# EAGLE design humidor_controller_v30 (EAGLE 5.06)
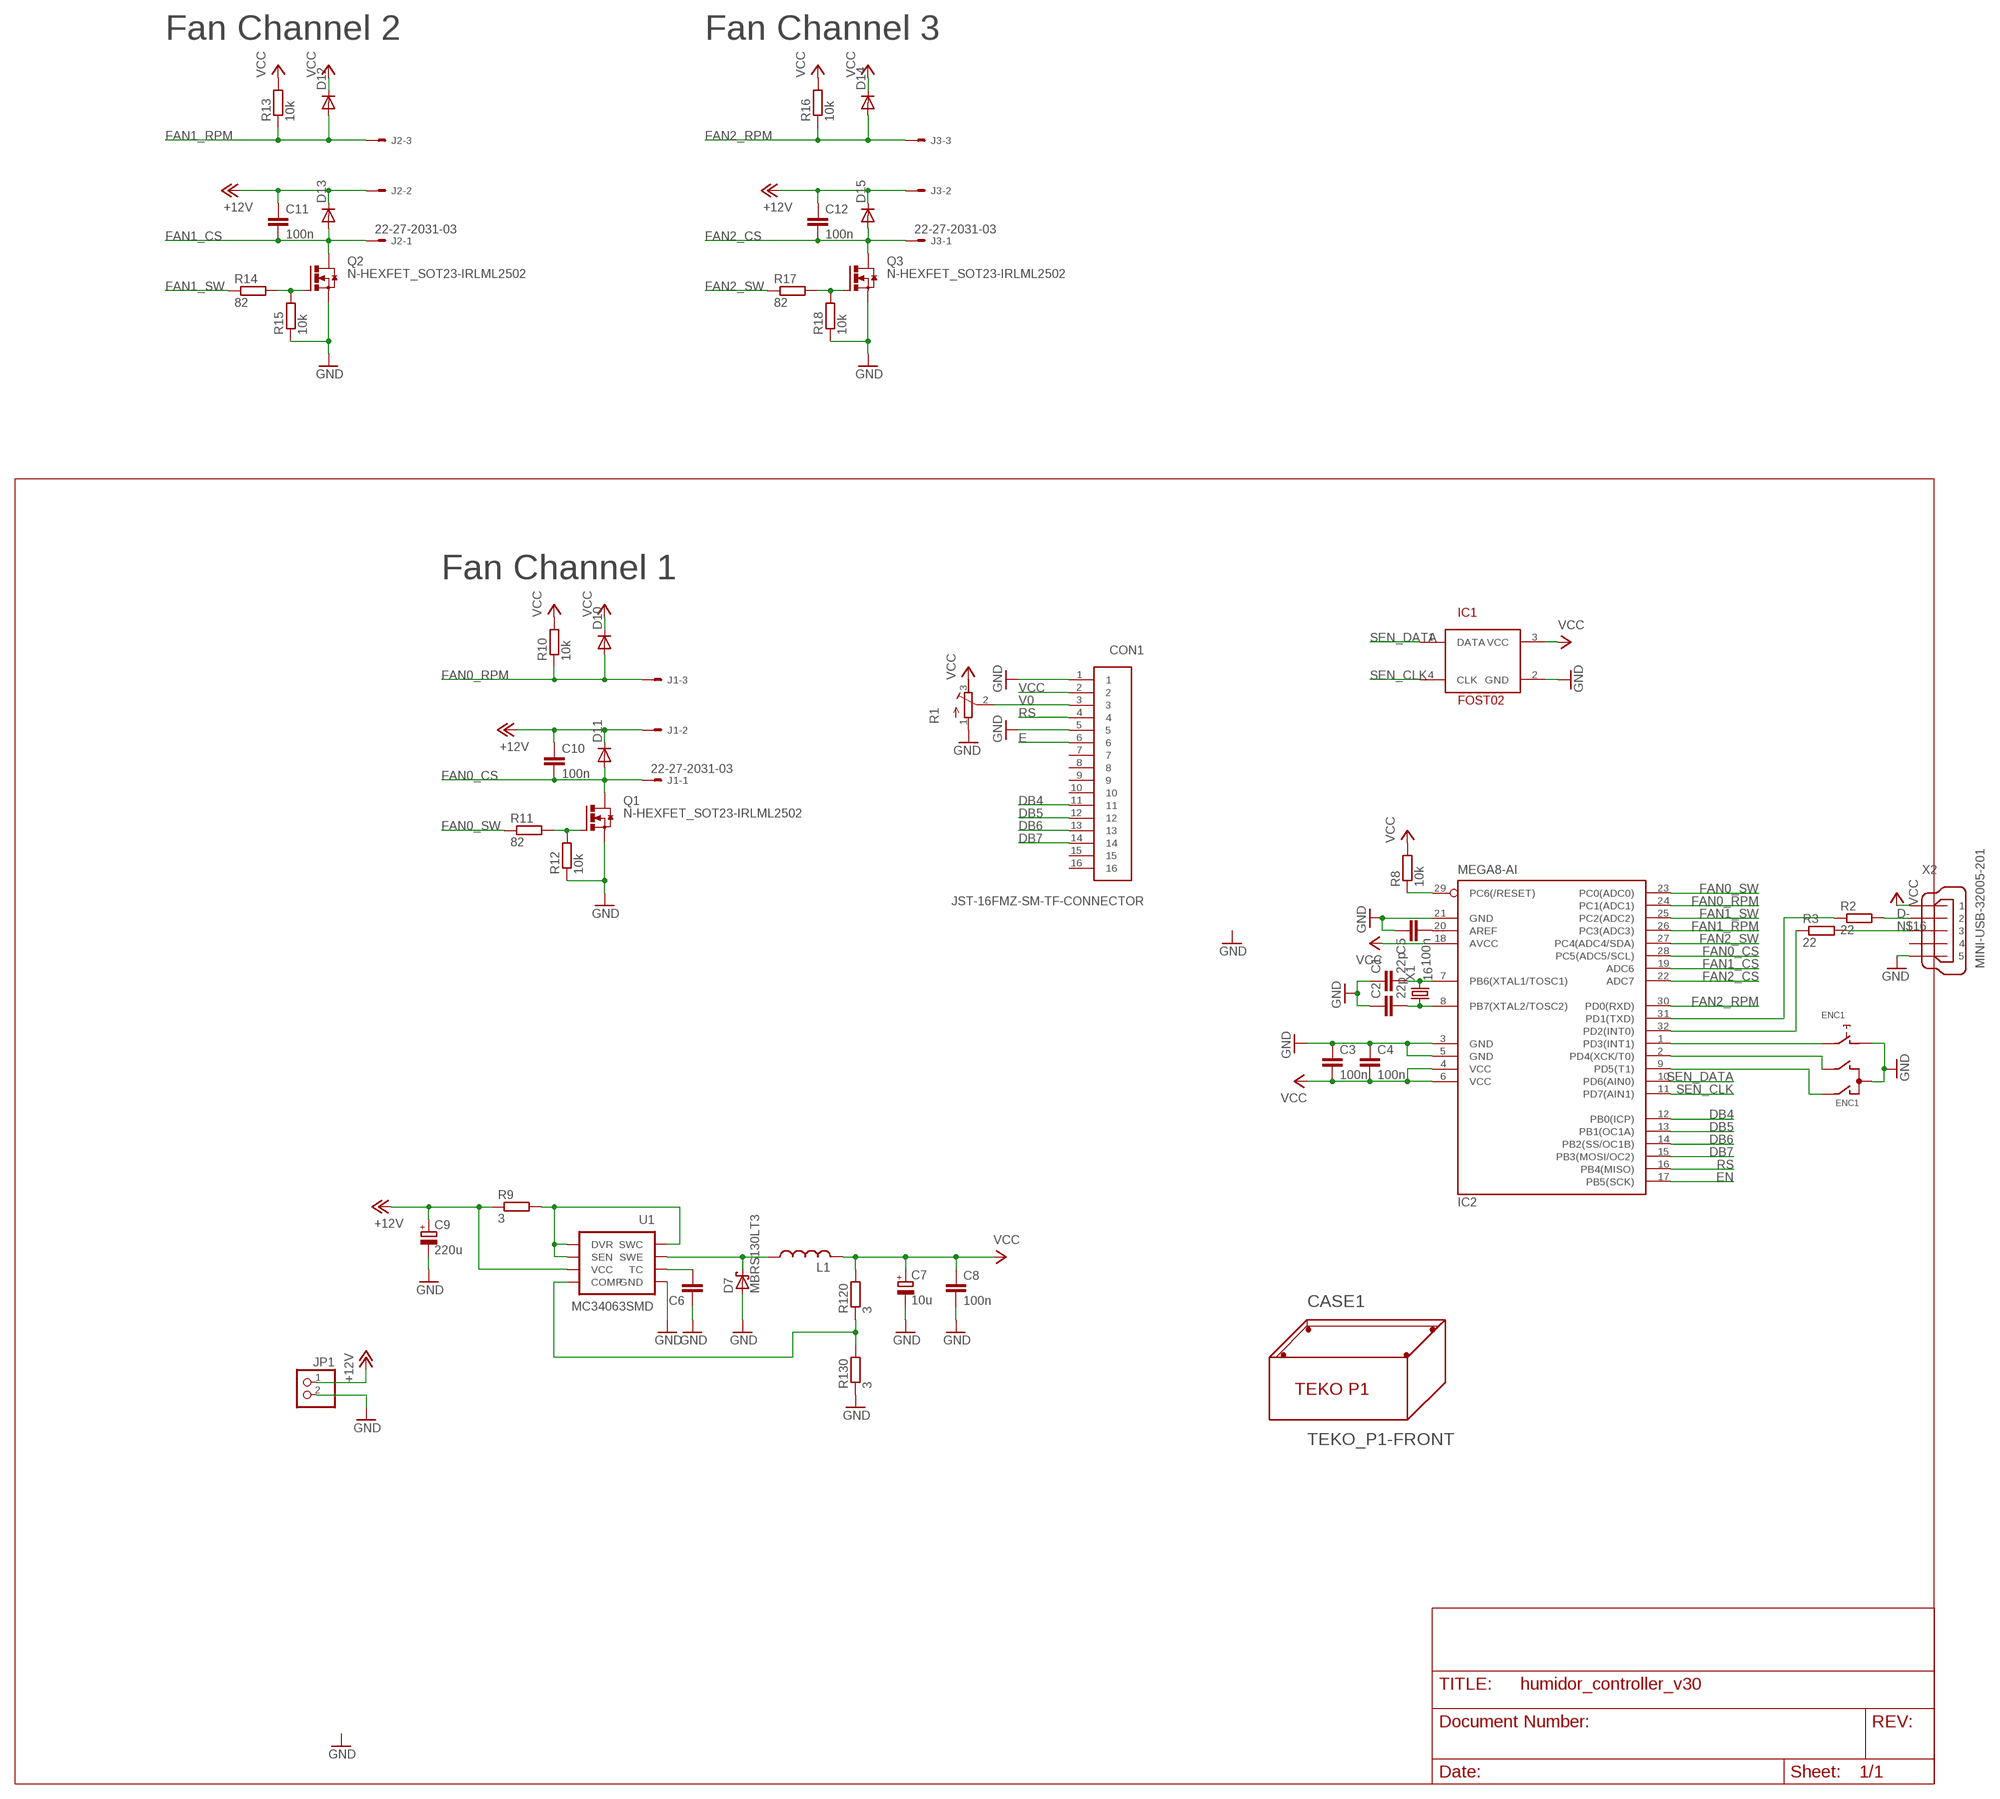
[diagram p0: schematic, sheet 1]

## Parts
C1  22p  C-EUC0805  [C0805]
C2  22p  C-EUC0805  [C0805]
C3  100n  C-EUC0805  [C0805]
C4  100n  C-EUC0805  [C0805]
C5  100n  C-EUC0805  [C0805]
C6  C-EUC0805  [C0805]
C7  10u  CPOL-EUD  [PANASONIC_D]
C8  100n  C-EUC0805  [C0805]
C9  220u  CPOL-EUG  [PANASONIC_G]
C10  100n  C-EUC0805  [C0805]
C11  100n  C-EUC0805  [C0805]
C12  100n  C-EUC0805  [C0805]
CASE1  TEKO_P1-FRONT  [TEKO_P1_FRONT]
CON1  JST-16FMZ-SM-TF-CONNECTOR  [FFC-16POS-SMT-1MM-HORIZ]
D7  MBRS130LT3  [SMB]
D10  DIODE-SOD323-R  [SOD323-R]
D11  DIODE-SOD323-R  [SOD323-R]
D12  DIODE-SOD323-R  [SOD323-R]
D13  DIODE-SOD323-R  [SOD323-R]
D14  DIODE-SOD323-R  [SOD323-R]
D15  DIODE-SOD323-R  [SOD323-R]
ENC1  NOBLE_RE0124  [RE0124]
IC1  FOST02  [FOST02]
IC2  MEGA8-AI  [TQFP32-08]
J1  22-27-2031-03  [6410-03]
J2  22-27-2031-03  [6410-03]
J3  22-27-2031-03  [6410-03]
JP1  PINHD-1X2  [1X02]
L1  L-TDK-SLF12565  [L_TDK-SLF12565]
Q1  N-HEXFET_SOT23-IRLML2502  [SOT23]
Q2  N-HEXFET_SOT23-IRLML2502  [SOT23]
Q3  N-HEXFET_SOT23-IRLML2502  [SOT23]
R1  R-TRIMM64W  [RTRIM64W]
R2  22  R-EU_R0805  [R0805]
R3  22  R-EU_R0805  [R0805]
R8  10k  R-EU_R0805  [R0805]
R9  3  R-EU_R0805  [R0805]
R10  10k  R-EU_R0805  [R0805]
R11  82  R-EU_R0805  [R0805]
R12  10k  R-EU_R0805  [R0805]
R13  10k  R-EU_R0805  [R0805]
R14  82  R-EU_R0805  [R0805]
R15  10k  R-EU_R0805  [R0805]
R16  10k  R-EU_R0805  [R0805]
R17  82  R-EU_R0805  [R0805]
R18  10k  R-EU_R0805  [R0805]
R120  3  R-EU_R0805  [R0805]
R130  3  R-EU_R0805  [R0805]
U1  MC34063SMD  [SO08]
X1  16  CRYSTAL5X3  [CRYSTAL-SMD-5X3]
X2  MINI-USB-32005-201  [32005-201]

## Nets
+12V: C9.+ C10.1 C11.1 C12.1 D11.C D13.C D15.C J1.2 J2.2 J3.2 JP1.1 R9.1 U1.6(VCC)
D+: IC2.32(PD2(INT0)) R3.1
D-: R2.2 X2.2
DB4: CON1.11 IC2.12(PB0(ICP))
DB5: CON1.12 IC2.13(PB1(OC1A))
DB6: CON1.13 IC2.14(PB2(SS/OC1B))
DB7: CON1.14 IC2.15(PB3(MOSI/OC2))
E: CON1.6
EN: IC2.17(PB5(SCK))
FAN0_CS: C10.2 D11.A IC2.28(PC5(ADC5/SCL)) J1.1 Q1.3(D)
FAN0_RPM: D10.A IC2.24(PC1(ADC1)) J1.3 R10.1
FAN0_SW: IC2.23(PC0(ADC0)) R11.1
FAN1_CS: C11.2 D13.A IC2.19(ADC6) J2.1 Q2.3(D)
FAN1_RPM: D12.A IC2.26(PC3(ADC3)) J2.3 R13.1
FAN1_SW: IC2.25(PC2(ADC2)) R14.1
FAN2_CS: C12.2 D15.A IC2.22(ADC7) J3.1 Q3.3(D)
FAN2_RPM: D14.A IC2.30(PD0(RXD)) J3.3 R16.1
FAN2_SW: IC2.27(PC4(ADC4/SDA)) R17.1
GND: C1.1 C2.1 C3.1 C4.1 C5.1 C6.1 C7.- C8.2 C9.- CON1.1 CON1.5 D7.A ENC1.+ ENC1.C IC1.2(GND) IC2.3(GND) IC2.5(GND) IC2.21(GND) JP1.2 Q1.2(S) Q2.2(S) Q3.2(S) R1.1(E) R12.1 R15.1 R18.1 R130.1 U1.4(GND) X2.5
N$1: IC2.29(PC6(/RESET)) R8.1
N$2: C2.2 IC2.8(PB7(XTAL2/TOSC2)) X1.1
N$3: C1.2 IC2.7(PB6(XTAL1/TOSC1)) X1.3
N$4: Q2.1(G) R14.2 R15.2
N$5: Q3.1(G) R17.2 R18.2
N$6: R9.2 U1.1(SWC) U1.7(SEN) U1.8(DVR)
N$7: C5.2 IC2.20(AREF)
N$8: D7.C L1.P$1 U1.2(SWE)
N$9: Q1.1(G) R11.2 R12.2
N$10: C6.2 U1.3(TC)
N$11: IC2.31(PD1(TXD)) R2.1
N$12: R120.1 R130.2 U1.5(COMP)
N$13: ENC1.- IC2.1(PD3(INT1))
N$14: ENC1.B IC2.2(PD4(XCK/T0))
N$15: ENC1.A IC2.9(PD5(T1))
N$16: R3.2 X2.3
RS: CON1.4 IC2.16(PB4(MISO))
SEN_CLK: IC1.4(CLK) IC2.11(PD7(AIN1))
SEN_DATA: IC1.1(DATA) IC2.10(PD6(AIN0))
V0: CON1.3 R1.2(S)
VCC: C3.2 C4.2 C7.+ C8.1 CON1.2 D10.C D12.C D14.C IC1.3(VCC) IC2.4(VCC) IC2.6(VCC) IC2.18(AVCC) L1.P$2 R1.3(A) R8.2 R10.2 R13.2 R16.2 R120.2 X2.1
Unconnected: CON1.7 CON1.8 CON1.9 CON1.10 CON1.15 CON1.16 X2.4

## Notes on the sheet
- Fan Channel 2 | Fan Channel 3
- Fan Channel 1

## Library data of the parts
C1 C2 C6 C8 = rcl:C-EU: CAPACITOR, European symbol
C3-C5 C10-C12 = resistor:C-EU: CAPACITOR, European symbol
C7 C9 = rcl:CPOL-EU: POLARIZED CAPACITOR, European symbol
CASE1 = ferdinandkeil:TEKO_P1-: TEKO P1 Case - Serie Optative 85 x 56 x 35 mm
CON1 = ferdinandkeil:JST-16FMZ-SM-TF-CONNECTOR
D7 = diode:MBRS130LT3: Schottky Power Rectifier Source: http://www.onsemi.com/pub/Collateral/MBRS130LT3-D.PDF
D10-D15 = diode:DIODE-: DIODE
ENC1 = ferdinandkeil:NOBLE_RE0124: NOBLE RE0124 Rotary Encoder w/ Push-Button
IC1 = RFMxx:FOST02
IC2 = atmel:MEGA8: MICROCONTROLLER 8 Kbytes FLASH, 1 kbytes SRAM, 512 bytes EEPROM, USART, 6-channel 10 bit ADC, 2-channel 8 bit ADC Pin compatible with Atmega48, ATMega88, ATMega168 Source: avr.lbr
J1-J3 = con-molex:22-?-03: CONNECTOR wire to board 2.54 mm (.1 inch) pitch header
JP1 = pinhead:PINHD-1X2: PIN HEADER
L1 = ferdinandkeil:L-TDK-SLF12565: TDK SLF Series SLD12565 Shielded SMD Power Inductor
Q1-Q3 = ferdinandkeil:N-HEXFET_?-*: HEXFET® Power MOSFET
R1 = rcl:R-TRIMM: Trimm resistor
R2 R3 R8-R18 R120 R130 = resistor:R-EU_: RESISTOR, European symbol
U1 = SparkFun:MC34063
X1 = SparkFun:CRYSTAL: Crystals Various standard crystals. Proven footprints. Spark Fun Electronics SKU : COM-00534
X2 = con-cypressindustries:MINI-USB-: MINI USB-B Conector Source: www.cypressindustries.com

## Board
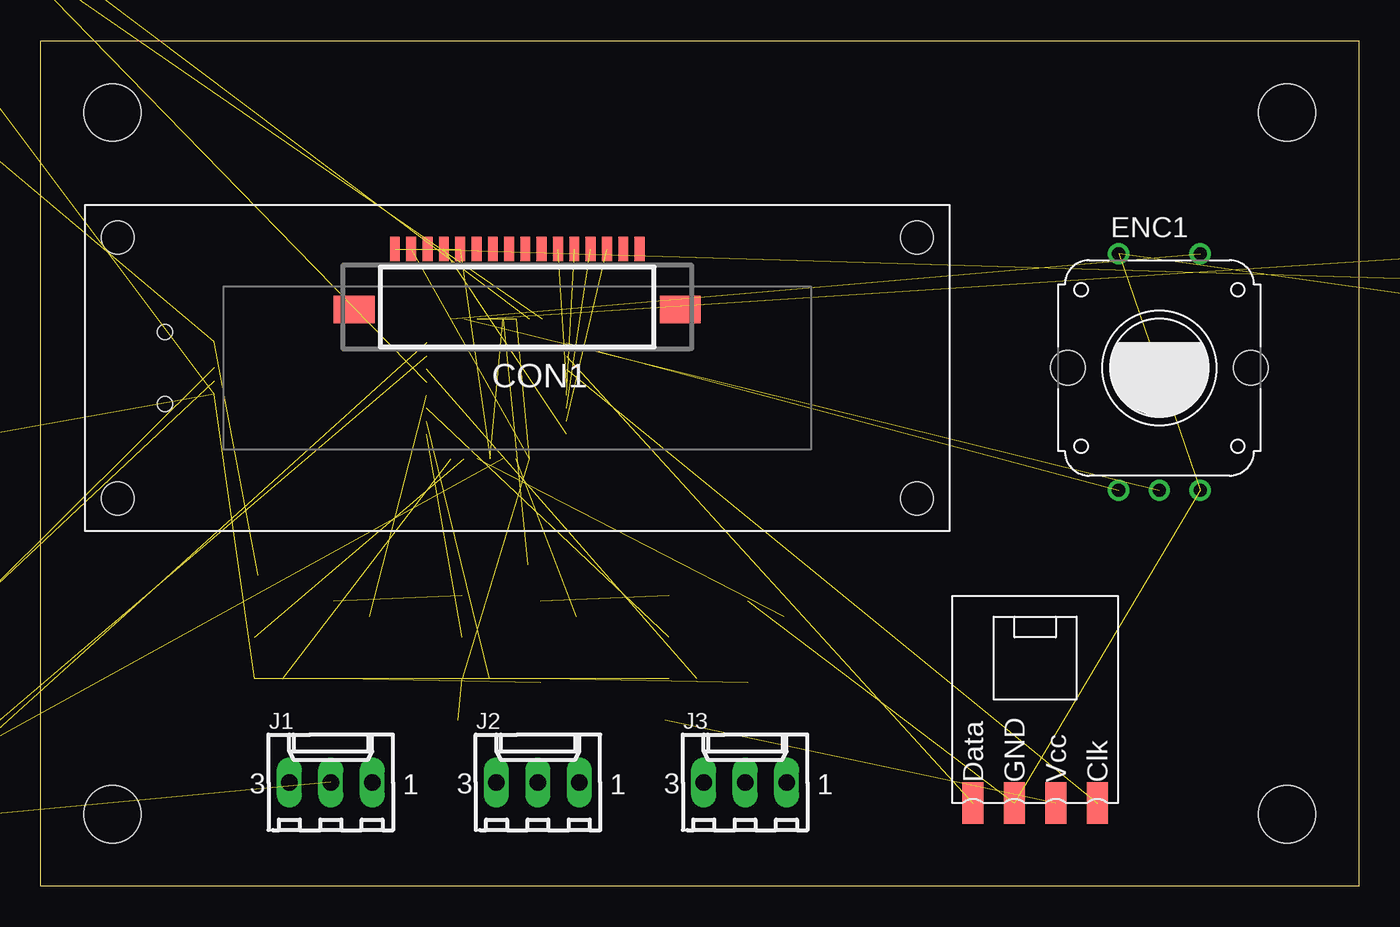
[diagram p1: board, top side]
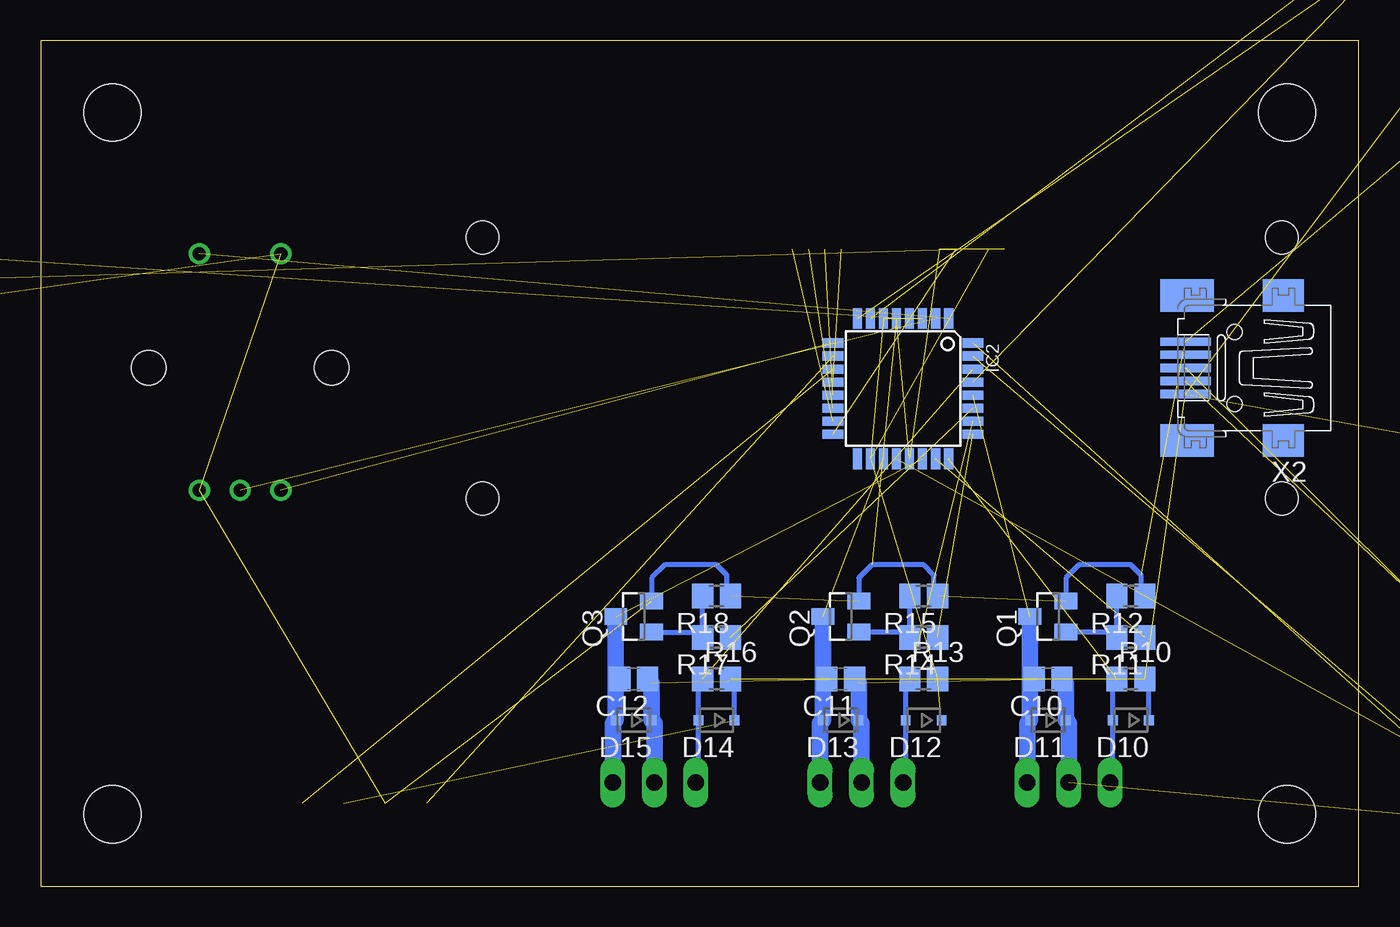
[diagram p2: board, bottom side, seen from below]

Size 80.8 x 51.8 mm. Coordinates in mm from the lower left corner, seen from the top.
Copper layers (1*16): Top 0.035mm / dielectric 1.5mm / Bottom 0.035mm
Design rules "default": minimum track width 10mil, minimum drill 24mil, track to track 8mil, track to pad 8mil, pad to pad 8mil, via to via 8mil, smd to smd 8mil, copper to edge 40mil, drill to drill 8mil, minimum pad ring 10mil, minimum via ring 8mil, stop-mask expansion 4mil, vias tented up to drill 0mil, thermal gap 10mil

### Footprints (pad centres in the part's own frame; a part is rotated, then mirrored left to right if it is on the bottom)
C0805 = smd 1.3 x 1.5: 1 -0.95,0; 2 0.95,0
C0805' = smd 1.3 x 1.5: 1 -0.85,0; 2 0.85,0
PANASONIC_D = smd 3 x 1.4: + 2.4,0; - -2.4,0
PANASONIC_G = smd 3.9 x 1.6: + 4.25,0; - -4.25,0
TEKO_P1_FRONT = hole 3.5: 4.4,4.4; 4.4,47.4; 76.4,4.4; 76.4,47.4
FFC-16POS-SMT-1MM-HORIZ = smd 0.6 x 1.5: 1 7.5,-2.2; 2 6.5,-2.2; 3 5.5,-2.2; 4 4.5,-2.2; 5 3.5,-2.2; 6 2.5,-2.2; 7 1.5,-2.2; 8 0.5,-2.2; 9 -0.5,-2.2; 10 -1.5,-2.2; 11 -2.5,-2.2; 12 -3.5,-2.2; 13 -4.5,-2.2; 14 -5.5,-2.2; 15 -6.5,-2.2; 16 -7.5,-2.2 | smd 2.5 x 1.7: 17 10,1.5; 18 -10,1.5
SMB = smd 2.4 x 2.4: A 2.2,0; C -2.2,0
SOD323-R = smd 0.6 x 0.6: A 1.1,0; C -1.1,0
RE0124 = drill 0.8 pad 1 round: + -2.5,7; - 2.5,7; A -2.5,-7.5; B 0,-7.5; C 2.5,-7.5 | hole 2.1: -5.6,0; 5.6,0
FOST02 = smd 1.27 x 2.54: 1 -3.81,-10.16; 2 -1.27,-10.16; 3 1.27,-10.16; 4 3.81,-10.16
TQFP32-08 = smd 1.27 x 0.559: 1 -4.293,2.8; 2 -4.293,2; 3 -4.293,1.2; 4 -4.293,0.4; 5 -4.293,-0.4; 6 -4.293,-1.2; 7 -4.293,-2; 8 -4.293,-2.8; 17 4.293,-2.8; 18 4.293,-2; 19 4.293,-1.2; 20 4.293,-0.4; 21 4.293,0.4; 22 4.293,1.2; 23 4.293,2; 24 4.293,2.8 | smd 0.559 x 1.27: 9 -2.8,-4.293; 10 -2,-4.293; 11 -1.2,-4.293; 12 -0.4,-4.293; 13 0.4,-4.293; 14 1.2,-4.293; 15 2,-4.293; 16 2.8,-4.293; 25 2.8,4.293; 26 2,4.293; 27 1.2,4.293; 28 0.4,4.293; 29 -0.4,4.293; 30 -1.2,4.293; 31 -2,4.293; 32 -2.8,4.293
6410-03 = drill 1.016 long: 1 2.54,0; 2 0,0; 3 -2.54,0
1X02 = drill 1.016 long: 1 -1.27,0; 2 1.27,0
L_TDK-SLF12565 = smd 3.2 x 2.5: P$1 0,-4.3; P$2 0,4.3
SOT23 = smd 1 x 1.4: 1 -0.95,-1.1; 2 0.95,-1.1; 3 0,1.1
RTRIM64W = drill 0.61 round: 1 1.27,-2.54; 2 1.27,0; 3 1.27,2.54
R0805 = smd 1.3 x 1.5: 1 -0.85,0; 2 0.85,0
SO08 = smd 0.61 x 2.21: 1 -1.905,-2.616; 2 -0.635,-2.616; 3 0.635,-2.616; 4 1.905,-2.616; 5 1.905,2.616; 6 0.635,2.616; 7 -0.635,2.616; 8 -1.905,2.616
LCD_HMC16223SG = hole 2: -24.5,-8; -24.5,8; 24.5,8; 24.5,-8
CRYSTAL-SMD-5X3 = smd 1.9 x 1.1: 1 -1.85,-1.15; 2 1.85,-1.15; 3 1.85,1.15; 4 -1.85,1.15
32005-201 = smd 3.1 x 0.5: 1 3,1.6; 2 3,0.8; 3 3,0; 4 3,-0.8; 5 3,-1.6 | smd 2.5 x 2: M1 -3,-4.45; M2 -3,4.45 | smd 3.3 x 2: M3 2.9,4.45; M4 2.9,-4.45 | hole 0.9: 0,2.2; 0,-2.2

### Placement (x,y rotation side)
C1  -63.5,96.52 0 top  (outside the outline)
C2  -68.58,96.52 0 top  (outside the outline)
C3  100n  [C0805']  -116.84,-40.64 0 top  (outside the outline)
C4  100n  [C0805']  -116.84,-46.99 0 top  (outside the outline)
C5  100n  [C0805']  -116.84,-53.34 0 top  (outside the outline)
C6  -116.84,-22.86 0 top  (outside the outline)
C7  -115.57,-60.96 0 top  (outside the outline)
C8  -116.84,-68.58 0 top  (outside the outline)
C9  -115.57,-73.66 0 top  (outside the outline)
C10  100n  [C0805']  19.05,12.7 180 bottom
C11  100n  [C0805']  31.75,12.7 180 bottom
C12  100n  [C0805']  44.45,12.7 180 bottom
CASE1  0,0 0 top
CON1  29.21,36.83 180 top
D7  -109.22,-8.89 0 top  (outside the outline)
D10  13.97,10.16 180 bottom
D11  19.05,10.16 180 bottom
D12  26.67,10.16 180 bottom
D13  31.75,10.16 180 bottom
D14  39.37,10.16 180 bottom
D15  44.45,10.16 180 bottom
ENC1  68.58,31.75 0 top
IC1  60.96,15.24 0 top
IC2  27.94,30.48 270 bottom
J1  17.78,6.35 0 top
J2  30.48,6.35 0 top
J3  43.18,6.35 0 top
JP1  -118.11,-83.82 0 top  (outside the outline)
L1  -105.41,5.08 0 top  (outside the outline)
Q1  19.05,16.51 90 bottom
Q2  31.75,16.51 90 bottom
Q3  44.45,16.51 90 bottom
R1  99.06,36.83 0 bottom  (outside the outline)
R2  -119.38,-90.17 0 top  (outside the outline)
R3  -119.38,-96.52 0 top  (outside the outline)
R8  -41.91,99.06 0 top  (outside the outline)
R9  -116.84,-16.51 0 top  (outside the outline)
R10  13.97,12.7 0 bottom
R11  13.97,15.24 180 bottom
R12  13.97,17.78 180 bottom
R13  26.67,12.7 0 bottom
R14  26.67,15.24 180 bottom
R15  26.67,17.78 180 bottom
R16  39.37,12.7 0 bottom
R17  39.37,15.24 180 bottom
R18  39.37,17.78 180 bottom
R120  -116.84,-27.94 0 top  (outside the outline)
R130  -116.84,-34.29 0 top  (outside the outline)
U1  -116.84,-8.89 0 top  (outside the outline)
U$1  [LCD_HMC16223SG]  29.21,31.75 0 top
X1  -57.15,97.79 0 top  (outside the outline)
X2  7.62,31.75 180 bottom

### Tracks (layer width: path | path; a pad name or v marks a point on that pad's centre or on a via)
+12V  (6 unrouted)
  Bottom 1.016: J1.2 17.78,9.99 D11.C 17.95,12.45 C10.1 | J2.2 30.48,9.99 D13.C 30.65,12.45 C11.1 | J3.2 43.18,9.99 D15.C 43.35,12.45 C12.1
D+  (1 unrouted)
D-  (1 unrouted)
DB4  (1 unrouted)
DB5  (1 unrouted)
DB6  (1 unrouted)
DB7  (1 unrouted)
FAN0_CS  (1 unrouted)
  Bottom 1.016: J1.1 20.32,9.99 D11.A 20.15,12.7 | 20.15,12.7 Q1.3 | 20.15,12.7 C10.2
FAN0_RPM  (1 unrouted)
  Bottom 0.305: J1.3 15.07,6.52 D10.A 15.07,12.45 R10.1
FAN0_SW  (1 unrouted)
FAN1_CS  (1 unrouted)
  Bottom 1.016: J2.1 33.02,9.99 D13.A 32.85,12.7 | 32.85,12.7 Q2.3 | 32.85,12.7 C11.2
FAN1_RPM  (1 unrouted)
  Bottom 0.305: J2.3 27.77,6.52 D12.A 27.77,12.45 R13.1
FAN1_SW  (1 unrouted)
FAN2_CS  (1 unrouted)
  Bottom 1.016: J3.1 45.72,9.99 D15.A 45.55,12.7 | 45.55,12.7 Q3.3 | 45.55,12.7 C12.2
FAN2_RPM  (1 unrouted)
  Bottom 0.305: J3.3 40.47,6.52 D14.A 40.47,12.45 R16.1
FAN2_SW  (1 unrouted)
GND  (25 unrouted)
  Bottom 0.305: Q1.2 17.95,18.88 17.14,19.68 13.97,19.68 13.34,19.05 13.34,18 R12.1 | Q2.2 30.65,18.88 29.84,19.68 26.67,19.68 26.04,19.05 26.04,18 R15.1 | Q3.2 43.35,18.88 42.55,19.68 39.37,19.68 38.73,19.05 38.73,18 R18.1
N$1  (1 unrouted)
N$2  (2 unrouted)
N$3  (2 unrouted)
N$4
  Bottom 0.305: Q2.1 27.84,15.56 R14.2 R15.2
N$5
  Bottom 0.305: R18.2 R17.2 40.54,15.56 Q3.1
N$6  (3 unrouted)
N$7  (1 unrouted)
N$8  (2 unrouted)
N$9
  Bottom 0.305: Q1.1 15.14,15.56 R11.2 R12.2
N$10  (1 unrouted)
N$11  (1 unrouted)
N$12  (2 unrouted)
N$13  (1 unrouted)
N$14  (1 unrouted)
N$15  (1 unrouted)
N$16  (1 unrouted)
RS  (1 unrouted)
SEN_CLK  (1 unrouted)
SEN_DATA  (1 unrouted)
V0  (1 unrouted)
VCC  (17 unrouted)
  Bottom 0.305: D10.C 12.87,12.45 R10.2 | D14.C 38.27,12.45 R16.2